# Altium schematic sheet output_header.SchDoc: Output Header
size A; DrawnBy: Andrew Pobrica; DocumentNumber: 3; SheetNumber: 3; SheetTotal: 7
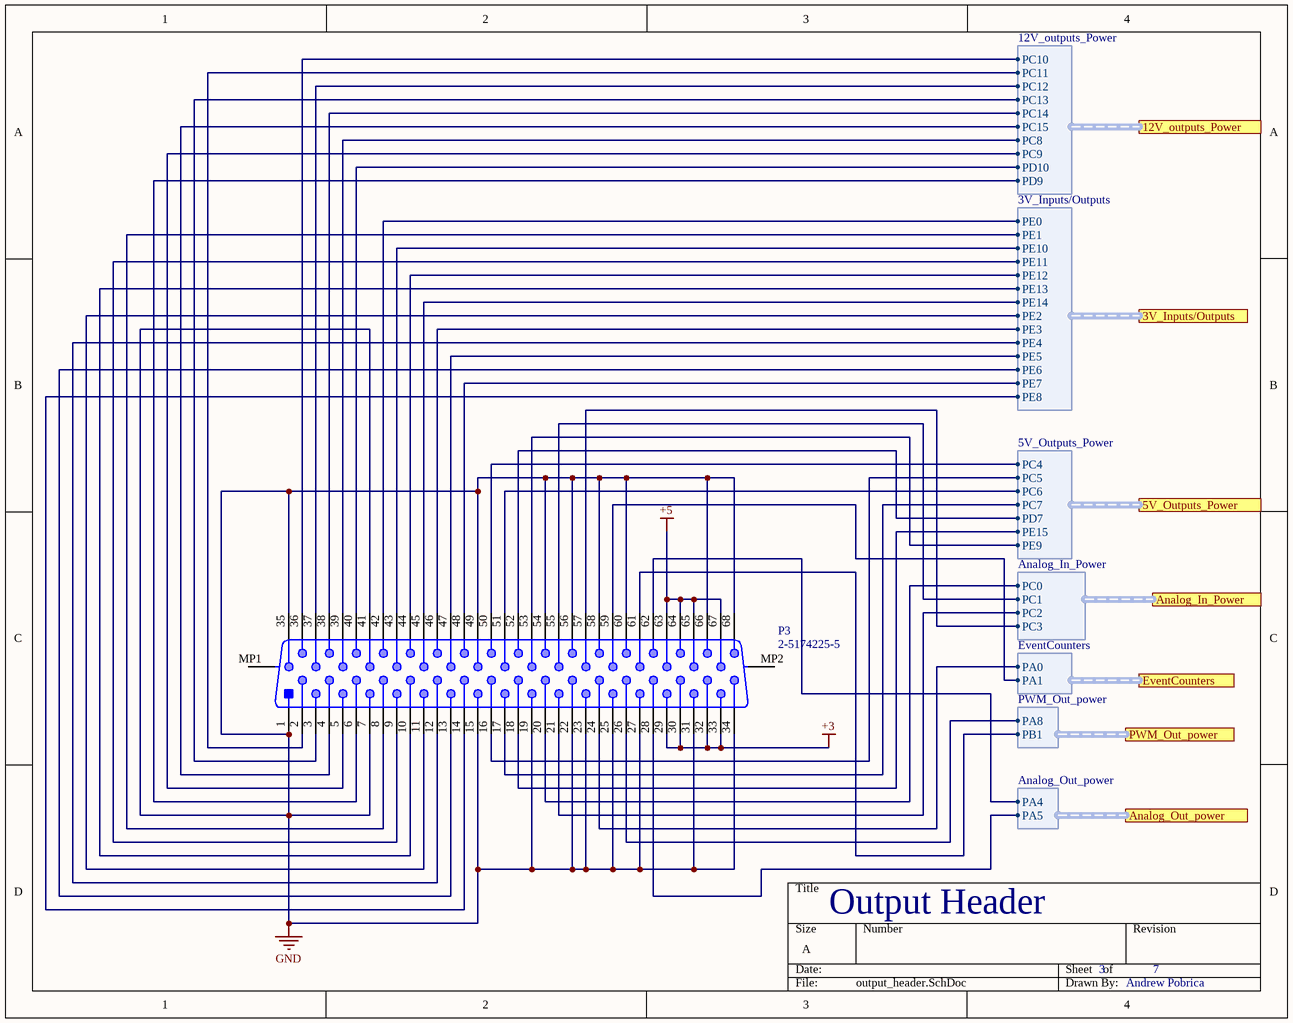
[diagram p0: output_header.SchDoc]

## Parts
P3  2-5174225-5  [TECO-2-5174225-5-68_V]

## Ports
3V_Inputs/Outputs (harness 3V_Inputs/Outputs), 5V_Outputs_Power (harness 5V_Outputs_Power), 12V_outputs_Power (harness 12V_outputs_Power), Analog_In_Power (harness Analog_In_Power), Analog_Out_power (harness Analog_Out_power), EventCounters (harness EventCounters), PWM_Out_power (harness PWM_Out_power)

## Harnesses
12V_outputs_Power: PC10, PC11, PC12, PC13, PC14, PC15, PC8, PC9, PD10, PD9
5V_Outputs_Power: PC4, PC5, PC6, PC7, PD7, PE15, PE9
EventCounters: PA0, PA1
3V_Inputs/Outputs: PE0, PE1, PE10, PE11, PE12, PE13, PE14, PE2, PE3, PE4, PE5, PE6, PE7, PE8
Analog_In_Power: PC0, PC1, PC2, PC3
PWM_Out_power: PA8, PB1
Analog_Out_power: PA4, PA5

## Nets
+3: P3.29 P3.30 P3.32 P3.33
+5: P3.63 P3.64 P3.65 P3.67
GND: P3.1 P3.7 P3.15 P3.19 P3.22 P3.23 P3.25 P3.27 P3.31 P3.34 P3.35 P3.41 P3.49 P3.54 P3.56 P3.58 P3.60 P3.66 P3.68
NetP3_2: P3.2 ; port 12V_outputs_Power.PC11
NetP3_3: P3.3 ; port 12V_outputs_Power.PC13
NetP3_4: P3.4 ; port 12V_outputs_Power.PC15
NetP3_5: P3.5 ; port 12V_outputs_Power.PC9
NetP3_6: P3.6 ; port 12V_outputs_Power.PD9
NetP3_8: P3.8 ; port 3V_Inputs/Outputs.PE1
NetP3_9: P3.9 ; port 3V_Inputs/Outputs.PE11
NetP3_10: P3.10 ; port 3V_Inputs/Outputs.PE13
NetP3_11: P3.11 ; port 3V_Inputs/Outputs.PE2
NetP3_12: P3.12 ; port 3V_Inputs/Outputs.PE4
NetP3_13: P3.13 ; port 3V_Inputs/Outputs.PE6
NetP3_14: P3.14 ; port 3V_Inputs/Outputs.PE8
NetP3_16: P3.16 ; port 5V_Outputs_Power.PC5
NetP3_17: P3.17 ; port 5V_Outputs_Power.PC7
NetP3_18: P3.18 ; port 5V_Outputs_Power.PE15
NetP3_20: P3.20 ; port Analog_In_Power.PC0
NetP3_21: P3.21 ; port Analog_In_Power.PC2
NetP3_24: P3.24 ; port EventCounters.PA0
NetP3_26: P3.26 ; port PWM_Out_power.PA8
NetP3_28: P3.28 ; port Analog_Out_power.PA5
NetP3_36: P3.36 ; port 12V_outputs_Power.PC10
NetP3_37: P3.37 ; port 12V_outputs_Power.PC12
NetP3_38: P3.38 ; port 12V_outputs_Power.PC14
NetP3_39: P3.39 ; port 12V_outputs_Power.PC8
NetP3_40: P3.40 ; port 12V_outputs_Power.PD10
NetP3_42: P3.42 ; port 3V_Inputs/Outputs.PE0
NetP3_43: P3.43 ; port 3V_Inputs/Outputs.PE10
NetP3_44: P3.44 ; port 3V_Inputs/Outputs.PE12
NetP3_45: P3.45 ; port 3V_Inputs/Outputs.PE14
NetP3_46: P3.46 ; port 3V_Inputs/Outputs.PE3
NetP3_47: P3.47 ; port 3V_Inputs/Outputs.PE5
NetP3_48: P3.48 ; port 3V_Inputs/Outputs.PE7
NetP3_50: P3.50 ; port 5V_Outputs_Power.PC4
NetP3_51: P3.51 ; port 5V_Outputs_Power.PC6
NetP3_52: P3.52 ; port 5V_Outputs_Power.PD7
NetP3_53: P3.53 ; port 5V_Outputs_Power.PE9
NetP3_55: P3.55 ; port Analog_In_Power.PC1
NetP3_57: P3.57 ; port Analog_In_Power.PC3
NetP3_59: P3.59 ; port EventCounters.PA1
NetP3_61: P3.61 ; port PWM_Out_power.PB1
NetP3_62: P3.62 ; port Analog_Out_power.PA4

Not connected (* = marked no-connect by the designer): P3 MP1 MP2

## Library data of the parts
P3 = CMP-2000-05410-1: Male D-Sub Connector, Pitch 1.27 mm, 2 x 34 Position, Height 10.3 mm, Tail Length 2.1 mm, -55 to 85 degC, RoHS, Tray; Manufacturer: TE Connectivity; Other Names: A33476; Featured Product: AMPLIMITED-SubminiatureConnectors; 3D Model: 2-5174225-5.pdf; Flange Feature: Housing/Shell(M2.5);Latchblocks; Voltage Rating: 100V; Product Training Modules: AMPLIMITED-SubConnectors; Dynamic Catalog: AMPLIMITE.050IISeries; Connector Type: Cap,MalePins; Connector Style: D-Type; Number of Positions: 68; Current Rating: 1A; Package Version: Rev. C1, 03/2011; Manufacturer URL: http://www.te.com/; Termination: Solder; Datasheet URL: http://www.te.com.cn/commerce/DocumentDelivery/DDEController?Action=showdoc&DocId=Customer+Drawing%7F5174225%7FC1%7Fpdf%7FEnglish%7FENG_CD_5174225_C1.pdf%7F2-5174225-5; Category: Connectors,Interconnects; Series: AMPLIMITE.050II; Shell Material, Finish: Zinc,NickelPlated; Housing Material: PolybutyleneTerephthalate(PBT); Family: D-SubConnectors; Package Reference: 2-5174225-5-68; Package URL: http://www.te.com.cn/commerce/DocumentDelivery/DDEController?Action=showdoc&DocId=Customer+Drawing%7F5174225%7FC1%7Fpdf%7FEnglish%7FENG_CD_5174225_C1.pdf%7F2-5174225-5; Contact Type: Signal; Number of Rows: 2; Contact Finish Thickness: 30µin(0.76µm); Package Description: Male D-Sub Connector, Pitch 1.27 mm, 2 x 34 Position, Height 10.3 mm, Tail Length 2.1 mm; Color: Black; RoHS Information: 2-5174225-5StatementofCompliance; Datasheet Version: Rev. C1, 03/2011; Shell Size, Connector Layout: 0.050Pitchx0.100RowtoRow; Mounting Type: ThroughHole,RightAngle; Operating Temperature: -55degC~85degC; Contact Finish: Gold; Features: Shielded; Standard Package: 4